# EAGLE board Alpha_Power_Board_v7 (EAGLE 9.6.2), part 1 of 2
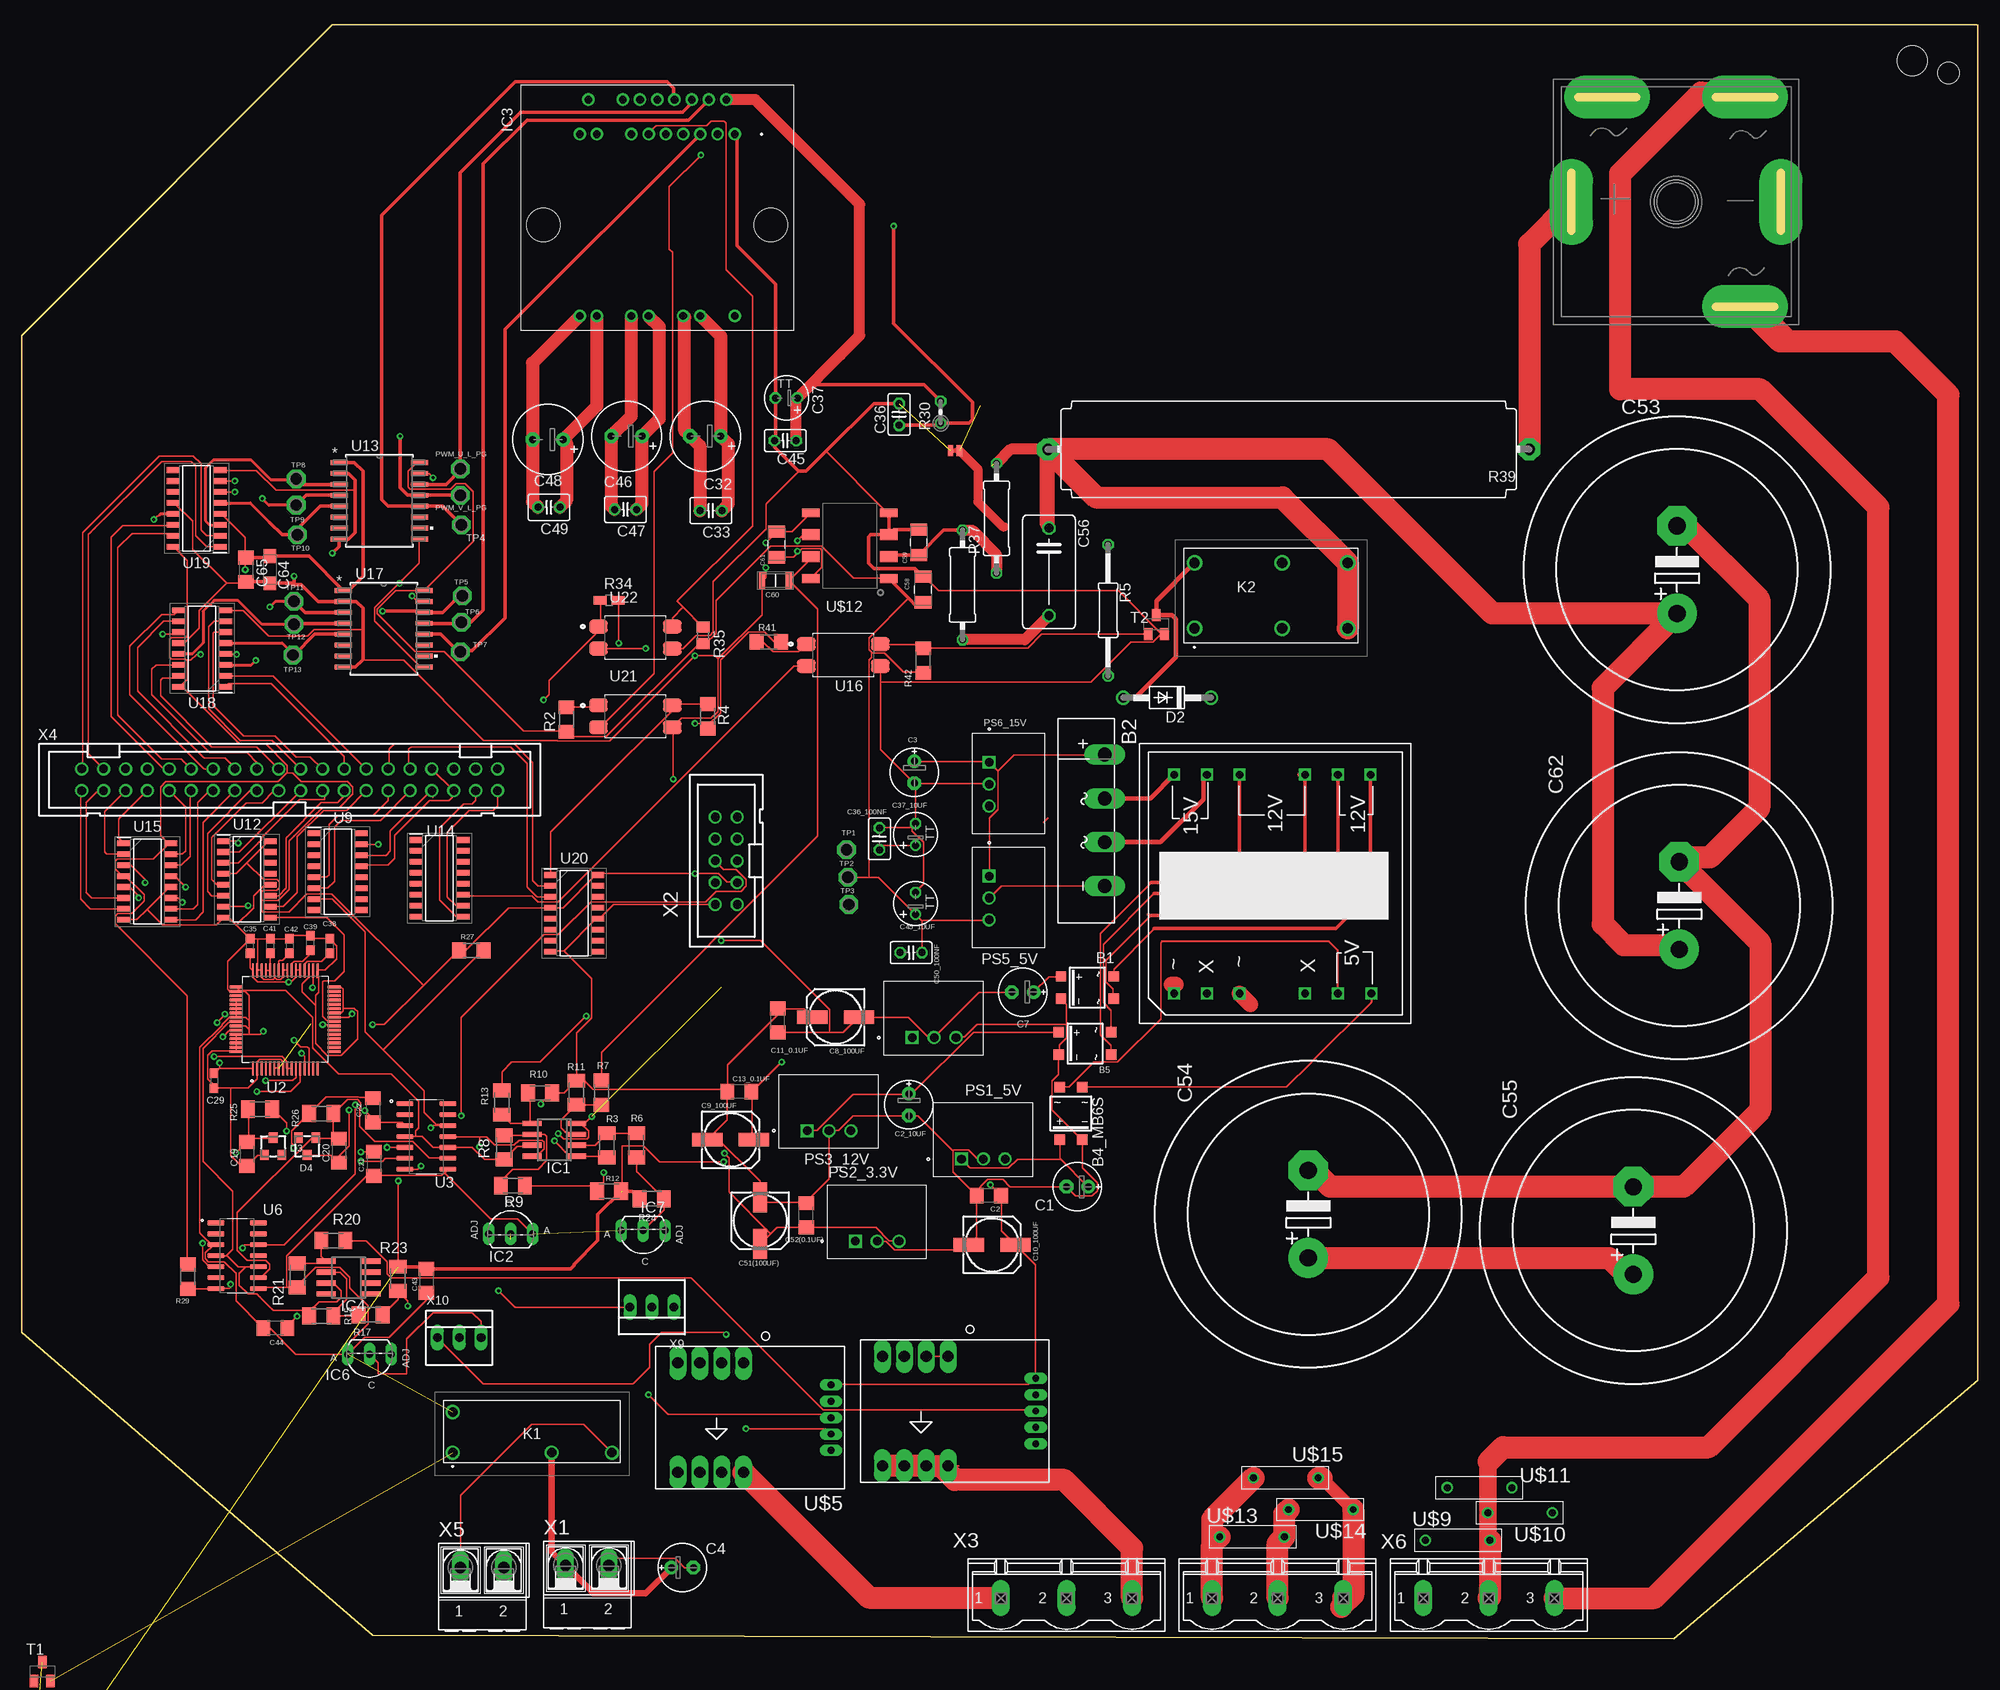
[diagram p7: board, top side]
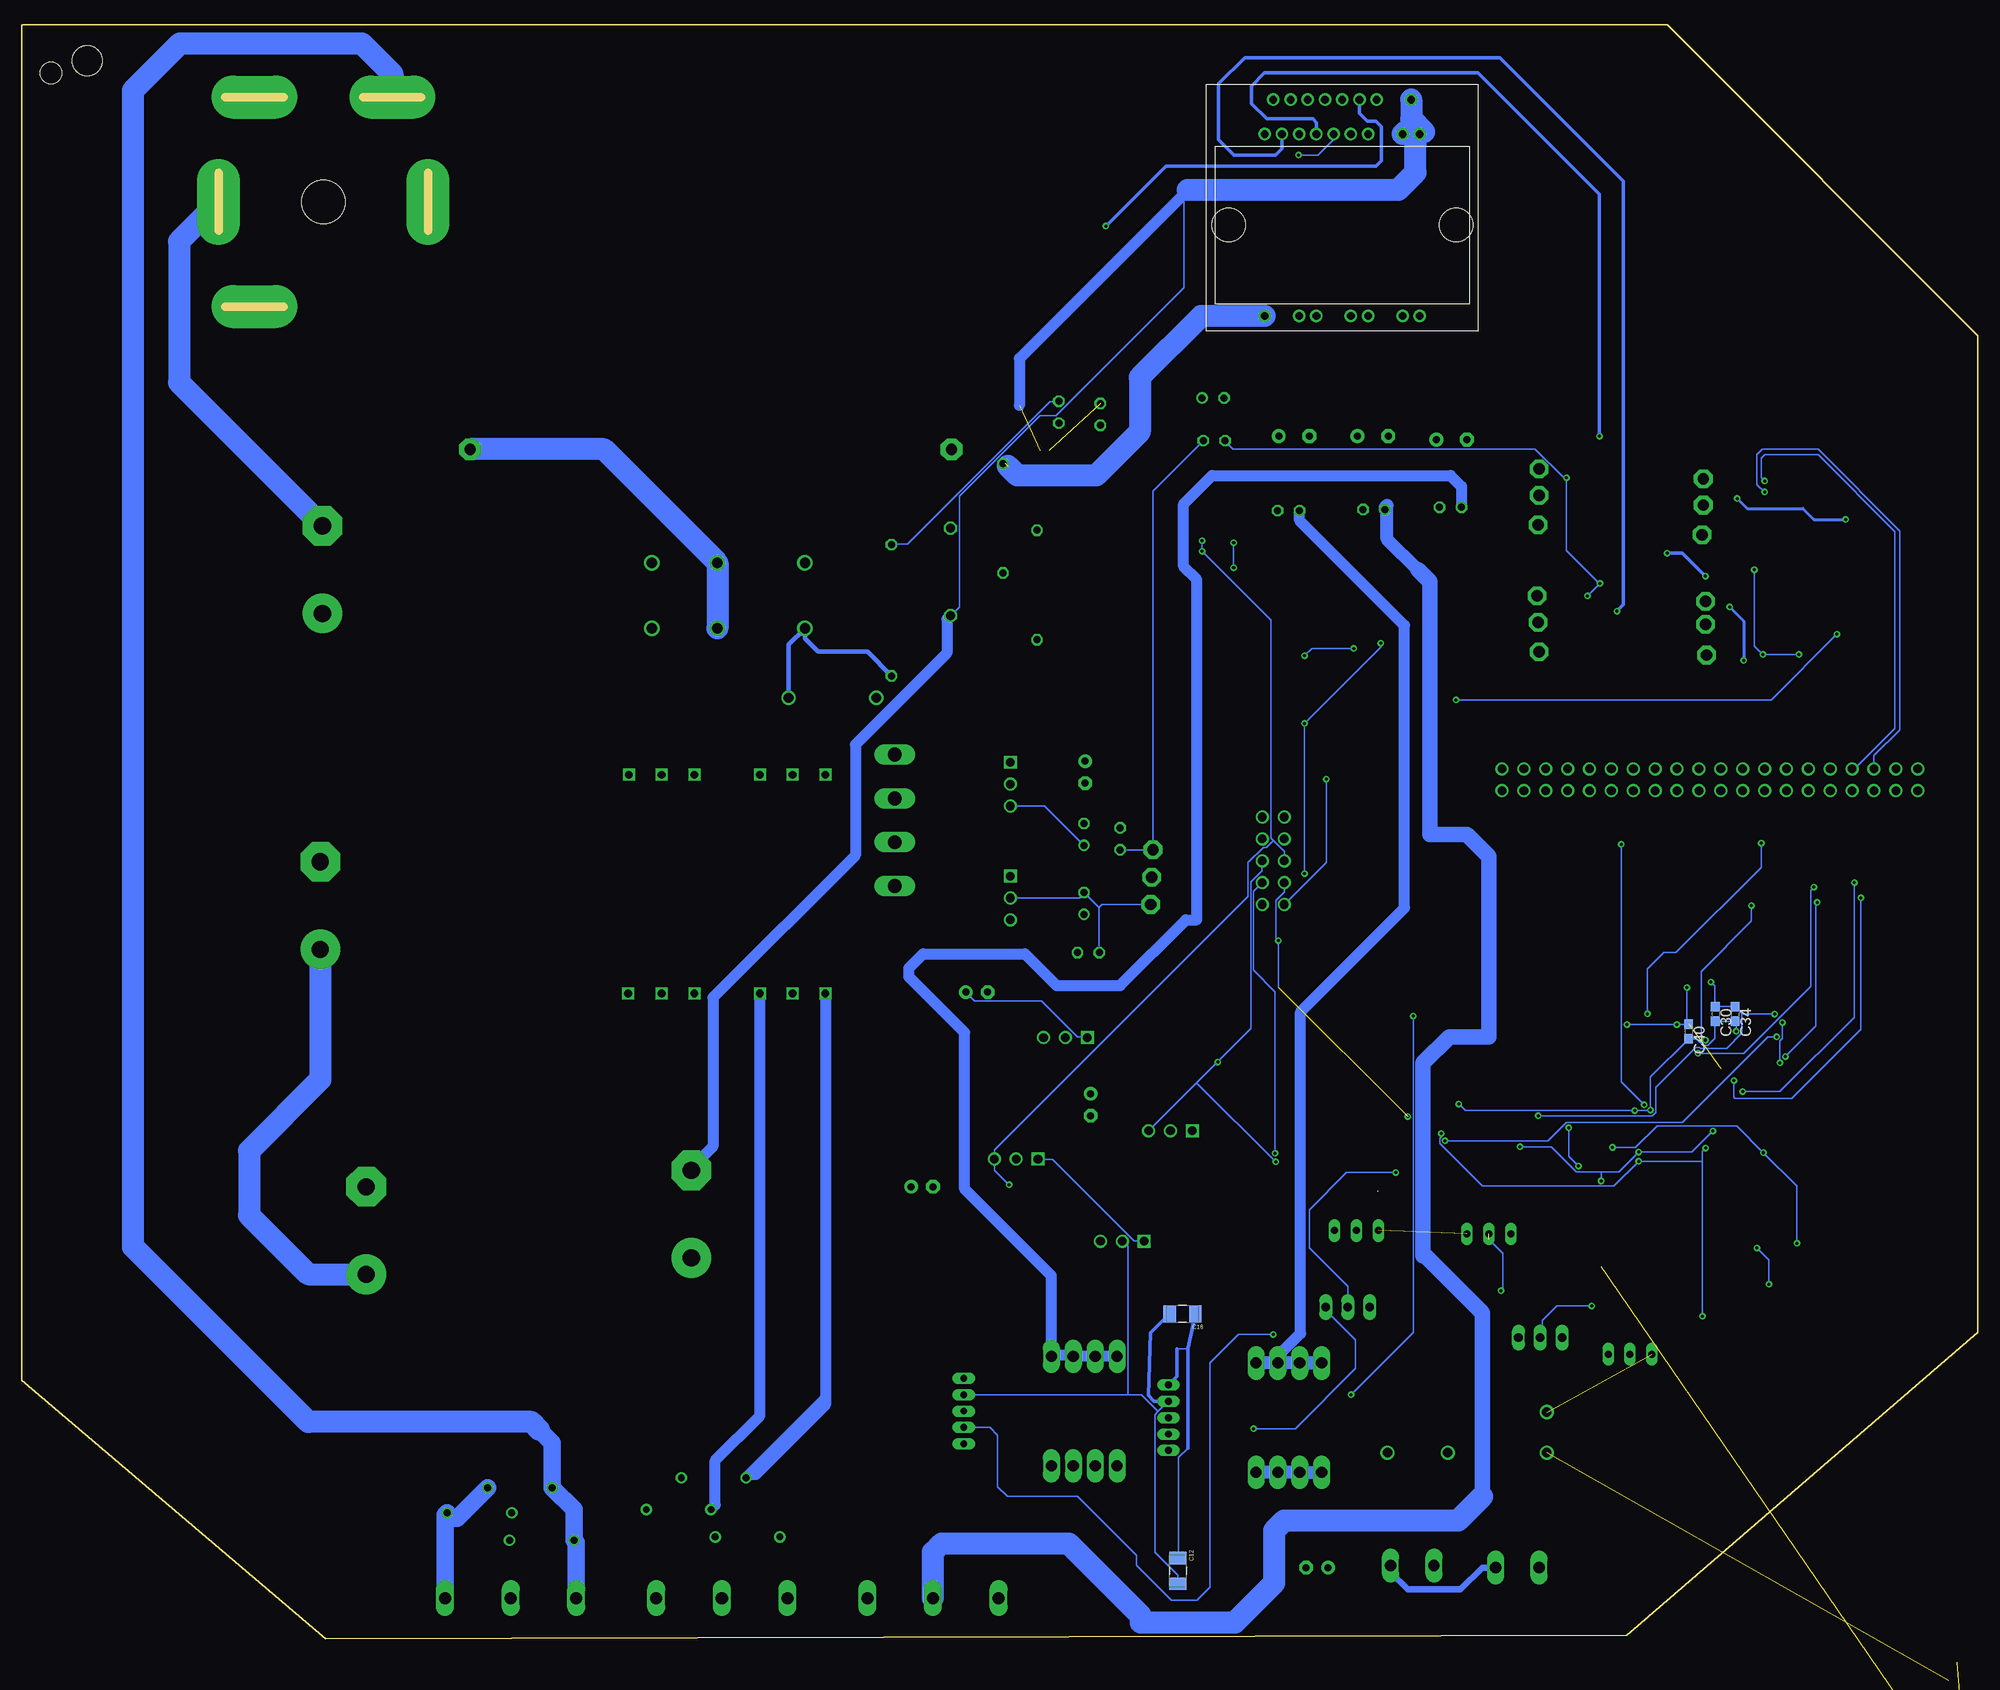
[diagram p8: board, bottom side, seen from below]

Size 227.08 x 187.33 mm. Coordinates in mm from the lower left corner, seen from the top.
Outline: 227.08,187.33 227.08,29.97 191.77,0 40.77,0.38 0,35.56 0,151.26 36.07,187.33 226.95,187.33
Copper layers (1+2*15+16): Top 0.035mm / dielectric 1.5mm / Route2 0.035mm / dielectric 0.15mm / Route15 0.035mm / dielectric 0.2mm / Bottom 0.035mm
Design rules "default *": minimum track width 6mil, minimum drill 0.35mm, track to track 6mil, track to pad 6mil, pad to pad 6mil, via to via 6mil, smd to smd 6mil, copper to edge 6mil, drill to drill 6mil, minimum pad ring 10mil, minimum via ring 8mil, stop-mask expansion 4mil, vias tented up to drill 0mil, thermal gap 10mil
Holes 3.5 mm at 219.46,183.13
Holes 5.08 mm at 192.02,166.75
Holes 2.5 mm at 223.65,181.74

## Footprints (pad centres in the part's own frame; a part is rotated, then mirrored left to right if it is on the bottom)
SOIC-4 = smd 1.2 x 1.2: + 1.3,3.05; - -1.3,3.05; ~1 -1.3,-3.05; ~2 1.3,-3.05
KBU = drill 1.6 long: + -7.62,2.54; - 7.62,2.54; AC1 -2.54,2.54; AC2 2.54,2.54
E2,5-6E = drill 0.813 pad 1.575: + -1.27,0 | drill 0.813 pad 1.575 octagon: - 1.27,0
C1206 = smd 1.6 x 1.8: 1 -1.4,0; 2 1.4,0
153CLV-0605 = smd 3.5 x 1.6: + 2.7,0; - -2.7,0
CAPC3316X140N = smd 1.42 x 1.96: 1 -1.492,0; 2 1.492,0
C0603 = smd 1.1 x 1: 1 -0.85,0; 2 0.85,0
E3,5-8 = drill 0.813 pad 1.6: + -1.778,0 | drill 0.813 pad 1.6 octagon: - 1.778,0
C025-030X050 = drill 0.813 octagon: 1 -1.27,0; 2 1.27,0
C025-025X050 = drill 0.813 octagon: 1 -1.27,0; 2 1.27,0
TT2D5 = drill 0.813: + -1.27,0 | drill 0.813 octagon: - 1.27,0
EB35D = drill 2.007 pad 4.597: + -5.08,0 | drill 2.007 pad 4.597 octagon: - 5.08,0
C102-064X133 = drill 1.016 octagon: 1 -5.08,0; 2 5.08,0
CAP150PF = smd 0.72 x 1.82: 1 -1.55,0; 2 1.55,0
SMC_P = smd 1.6 x 1.4: + -1.575,0; - 1.575,0
DO41-10 = drill 1.118: A 5.08,0; C -5.08,0
TO236 = smd 1 x 1.2: A -1,-1; C 0,1; NC 1,-1
SO08 = smd 0.6 x 2.2: 1 -1.905,-2.6; 2 -0.635,-2.6; 3 0.635,-2.6; 4 1.905,-2.6; 5 1.905,2.6; 6 0.635,2.6; 7 -0.635,2.6; 8 -1.905,2.6
TO92A_VREF = drill 0.813 long: A 2.54,-1.27; C 0,-1.27; R -2.54,-1.27
NFAQ1560R43T = drill 0.89 pad 1.446: 1 -9,-10.55; 2 -8,-14.55; 3 -7,-10.55; 4 -6,-14.55; 5 -5,-10.55; 6 -4,-14.55; 7 -3,-10.55; 8 -2,-14.55; 9 -1,-10.55; 10 0,-14.55; 11 1,-10.55; 12 2,-14.55; 13 3,-10.55; 14 4,-14.55; 17 7,-10.55; 18 8,-14.55; 19 9,-10.55; 20 9,10.55; 22 7,10.55; 26 3,10.55; 28 1,10.55; 32 -3,10.55; 34 -5,10.55; 38 -9,10.55 | hole 3.9: -13.2,0; 13.2,0
ALDP112W = drill 1.1 pad 1.65: 1 0,0; 2 11.5,0; 3 18.5,0; 4 0,4.7
DSP2ADC12V = drill 1.2 pad 1.8: 1 8.89,3.51; 5 -1.27,3.51; 8 -8.89,3.51; 9 -8.89,-4.11; 12 -1.27,-4.11; 16 8.89,-4.11
CONV_R-78E5.0-0.5 = drill 1 square: 1 -2.54,-2.25 | drill 1: 2 0,-2.25; 3 2.54,-2.25
P1-13 = drill 1.321 pad 2.159 octagon: TP 0,0
0204V = drill 0.813 octagon: 1 -1.27,0; 2 1.27,0
R1206 = smd 1.6 x 1.803: 1 -1.422,0; 2 1.422,0
M1206 = smd 1.6 x 2: 1 -1.4,0; 2 1.4,0
0207/15 = drill 0.813 octagon: 1 -7.62,0; 2 7.62,0
R0805W = smd 1.5 x 1: 1 -1.052,0; 2 1.052,0
R0805 = smd 1.3 x 1.5: 1 -0.95,0; 2 0.95,0
0309/12 = drill 0.813 octagon: 1 -6.35,0; 2 6.35,0
B20J50RE = drill 1.3 pad 2.54 octagon: 1 -27.94,0; 2 27.94,0
SOT23-BEC = smd 1 x 1.4: B -0.95,-1.1; C 0,1.1; E 0.95,-1.1
QFP50P1200X1200X160-64N = smd 1.57 x 0.28: 1 -5.67,3.75; 2 -5.67,3.25; 3 -5.67,2.75; 4 -5.67,2.25; 5 -5.67,1.75; 6 -5.67,1.25; 7 -5.67,0.75; 8 -5.67,0.25; 9 -5.67,-0.25; 10 -5.67,-0.75; 11 -5.67,-1.25; 12 -5.67,-1.75; 13 -5.67,-2.25; 14 -5.67,-2.75; 15 -5.67,-3.25; 16 -5.67,-3.75; 33 5.67,-3.75; 34 5.67,-3.25; 35 5.67,-2.75; 36 5.67,-2.25; 37 5.67,-1.75; 38 5.67,-1.25; 39 5.67,-0.75; 40 5.67,-0.25; 41 5.67,0.25; 42 5.67,0.75; 43 5.67,1.25; 44 5.67,1.75; 45 5.67,2.25; 46 5.67,2.75; 47 5.67,3.25; 48 5.67,3.75 | smd 0.28 x 1.57: 17 -3.75,-5.67; 18 -3.25,-5.67; 19 -2.75,-5.67; 20 -2.25,-5.67; 21 -1.75,-5.67; 22 -1.25,-5.67; 23 -0.75,-5.67; 24 -0.25,-5.67; 25 0.25,-5.67; 26 0.75,-5.67; 27 1.25,-5.67; 28 1.75,-5.67; 29 2.25,-5.67; 30 2.75,-5.67; 31 3.25,-5.67; 32 3.75,-5.67; 49 3.75,5.67; 50 3.25,5.67; 51 2.75,5.67; 52 2.25,5.67; 53 1.75,5.67; 54 1.25,5.67; 55 0.75,5.67; 56 0.25,5.67; 57 -0.25,5.67; 58 -0.75,5.67; 59 -1.25,5.67; 60 -1.75,5.67; 61 -2.25,5.67; 62 -2.75,5.67; 63 -3.25,5.67; 64 -3.75,5.67
SOIC127P600X175-14N = smd 1.97 x 0.6: 1 -2.475,3.81; 2 -2.475,2.54; 3 -2.475,1.27; 4 -2.475,0; 5 -2.475,-1.27; 6 -2.475,-2.54; 7 -2.475,-3.81; 8 2.475,-3.81; 9 2.475,-2.54; 10 2.475,-1.27; 11 2.475,0; 12 2.475,1.27; 13 2.475,2.54; 14 2.475,3.81
SOIC_16 = smd 1.525 x 0.65: 1 -2.712,4.445; 2 -2.712,3.175; 3 -2.712,1.905; 4 -2.712,0.635; 5 -2.712,-0.635; 6 -2.712,-1.905; 7 -2.712,-3.175; 8 -2.712,-4.445; 9 2.712,-4.445; 10 2.712,-3.175; 11 2.712,-1.905; 12 2.712,-0.635; 13 2.712,0.635; 14 2.712,1.905; 15 2.712,3.175; 16 2.712,4.445
RW_16_ADI = smd 1.981 x 0.559: 1 -4.686,4.445; 2 -4.686,3.175; 3 -4.686,1.905; 4 -4.686,0.635; 5 -4.686,-0.635; 6 -4.686,-1.905; 7 -4.686,-3.175; 8 -4.686,-4.445; 9 4.686,-4.445; 10 4.686,-3.175; 11 4.686,-1.905; 12 4.686,-0.635; 13 4.686,0.635; 14 4.686,1.905; 15 4.686,3.175; 16 4.686,4.445
SOIC254P975X460-4N = smd 2.13 x 1.57: 1 -4.29,1.27; 2 -4.29,-1.27; 3 4.29,-1.27; 4 4.29,1.27
T1P2S = drill 0.9 square: P$1 2.5,26.5; P$2 2.5,22.7; P$3 2.5,18.9; P$4 2.5,11.3; P$5 2.5,7.5; P$6 2.5,3.6; P$7 27.9,3.7; P$8 27.9,7.5; P$9 27.9,11.3; P$10 27.9,18.9; P$11 27.9,22.7; P$12 27.9,26.5
GND_CONNECT = smd 0.635 x 1.27: 1 -0.508,0; 2 0.508,0
LPSR-15-NP = drill 1.3 pad 1.9 long: 2 -4.42,-6.35; 3 -1.88,-6.35; 4 0.66,-6.35; 5 3.2,-6.35; 6 3.2,6.35; 7 0.66,6.35; 8 -1.88,6.35; 9 -4.42,6.35 | drill 0.8 pad 1.3 long: 11 -14.59,3.81; 12 -14.59,1.905; 13 -14.59,0; 14 -14.59,-1.905; 15 -14.59,-3.81
V250LT20AP = drill 0.8: 1 0,0; 2 7.5,0
HCPL-7510 = smd 1.016 x 2: 1 -3.82,-4.52; 4 3.8,-4.52; 5 3.8,4.52; 8 -3.82,4.52 | smd 1.27 x 2: 2 -1.28,-4.52; 3 1.26,-4.52; 6 1.26,4.52; 7 -1.28,4.52
3-PHASE-BRIDGE = drill 0.6 pad 5 long: P$1 2.1,14.25; P$2 26.4,14.25; P$3 6.25,26.4; P$4 22.25,26.4; P$5 22.25,2.1
AK500/2-H = drill 1.321 long: 1 -2.515,0; 2 2.515,0
PAK100/2500-10 = drill 1 pad 1.422: 1 -5.08,-1.27; 2 -5.08,1.27; 3 -2.54,-1.27; 4 -2.54,1.27; 5 0,-1.27; 6 0,1.27; 7 2.54,-1.27; 8 2.54,1.27; 9 5.08,-1.27; 10 5.08,1.27
GMSTBV3 = drill 1.397 long: 1 -7.62,0; 2 0,0; 3 7.62,0
PAK100/2500-40 = drill 1 pad 1.422: 1 -24.13,-1.27; 2 -24.13,1.27; 3 -21.59,-1.27; 4 -21.59,1.27; 5 -19.05,-1.27; 6 -19.05,1.27; 7 -16.51,-1.27; 8 -16.51,1.27; 9 -13.97,-1.27; 10 -13.97,1.27; 11 -11.43,-1.27; 12 -11.43,1.27; 13 -8.89,-1.27; 14 -8.89,1.27; 15 -6.35,-1.27; 16 -6.35,1.27; 17 -3.81,-1.27; 18 -3.81,1.27; 19 -1.27,-1.27; 20 -1.27,1.27; 21 1.27,-1.27; 22 1.27,1.27; 23 3.81,-1.27; 24 3.81,1.27; 25 6.35,-1.27; 26 6.35,1.27; 27 8.89,-1.27; 28 8.89,1.27; 29 11.43,-1.27; 30 11.43,1.27; 31 13.97,-1.27; 32 13.97,1.27; 33 16.51,-1.27; 34 16.51,1.27; 35 19.05,-1.27; 36 19.05,1.27; 37 21.59,-1.27; 38 21.59,1.27; 39 24.13,-1.27; 40 24.13,1.27
22-23-2031 = drill 1 long: 1 -2.54,0; 2 0,0; 3 2.54,0

## Placement (x,y rotation side)
B1  MB6S  [SOIC-4]  123.7,75.56 90 top
B2  KBU0101  [KBU]  123.19,95 270 top
B4_MB6S  MB6S  [SOIC-4]  121.79,60.96 180 top
B5  MB6S  [SOIC-4]  123.44,69.09 90 top
C1  10uF  [E2,5-6E]  122.55,52.45 180 top
C2  0.1 uF  [C1206]  112.27,51.44 180 top
C2_10UF  10uF  [E2,5-6E]  103,61.98 270 top
C3  22uF  [E2,5-6E]  103.63,100.58 270 top
C4  10uF  [E2,5-6E]  76.71,8.26 0 top
C7  10uF  [E2,5-6E]  116.2,75.06 180 top
C8_100UF  100 uF  [153CLV-0605]  94.49,72.14 180 top
C9_100UF  100 uF  [153CLV-0605]  82.3,57.91 0 top
C10_100UF  100 uF  [153CLV-0605]  112.65,45.72 0 top
C11_0.1UF  0.1 uF  [C1206]  87.76,71.75 90 top
C12  0.1uF  [CAPC3316X140N]  92.84,7.87 270 bottom
C13_0.1UF  0.1 uF  [C1206]  83.31,63.5 180 top
C16  0.1uF  [CAPC3316X140N]  92.33,37.72 180 bottom
C19  0.1 uF  [C1206]  26.16,56.26 270 top
C20  0.1 uF  [C1206]  36.83,56.64 270 top
C21  0.1 uF  [C1206]  40.92,55.12 270 top
C22  0.1 uF  [C1206]  40.77,61.34 270 top
C29  1uF  [C0603]  22.35,64.77 270 top
C30  1uF  [C0603]  30.48,72.52 270 bottom
C32  1 - 47uF  [E3,5-8]  79.37,139.57 180 top
C33  100 nF  [C025-030X050]  80.01,130.94 180 top
C34  1uF  [C0603]  28.19,72.52 270 bottom
C35  1uF  [C0603]  26.54,80.39 90 top
C36  1 nF  [C025-025X050]  101.85,142.11 90 top
C36_100NF  100 nF  [C025-025X050]  99.57,92.84 90 top
C37  10 uF  [TT2D5]  88.77,144.02 180 top
C37_10UF  10 uF  [TT2D5]  103.76,93.34 90 top
C38  1uF  [C0603]  35.81,80.42 90 top
C39  1uF  [C0603]  33.53,80.77 90 top
C40  1uF  [C0603]  33.58,70.48 270 bottom
C41  10uF  [C0603]  28.88,80.39 90 top
C42  10uF  [C0603]  31.11,80.39 270 top
C43  0.1 uF  [C1206]  46.99,41.53 270 top
C44  0.1 uF  [C1206]  29.46,36.07 180 top
C45  100 nF  [C025-025X050]  88.65,139.06 180 top
C45_10UF  10 uF  [TT2D5]  103.76,85.34 90 top
C46  1 - 47uF  [E3,5-8]  70.23,139.57 180 top
C47  100 nF  [C025-030X050]  70.1,131.06 180 top
C48  1 - 47uF  [E3,5-8]  61.09,139.19 180 top
C49  100 nF  [C025-030X050]  61.21,131.32 180 top
C50_100NF  100 nF  [C025-025X050]  103.25,79.63 180 top
C51(100UF)  100 uF  [153CLV-0605]  85.73,48.51 270 top
C52(0.1UF)  0.1 uF  [C1206]  91.06,49.15 90 top
C53  4700uF  [EB35D]  192.15,124.08 90 top
C54  4700uF  [EB35D]  149.35,49.28 90 top
C55  4700uF  [EB35D]  187.07,47.37 90 top
C56  100 nF 450V  [C102-064X133]  119.25,123.83 270 top
C58  0.1uF  [CAPC3316X140N]  104.65,121.79 90 top
C59  0.01uF  [CAPC3316X140N]  104.14,127.25 90 top
C60  150pF  [CAP150PF]  87.5,122.81 180 top
C61  0.1uF  [CAPC3316X140N]  87.63,127 90 top
C62  4700uF  [EB35D]  192.4,85.09 90 top
C64  10 uF  [SMC_P]  28.83,124.08 270 top
C65  100 nF  [C1206]  26.03,124.08 270 top
D2  1N4004  [DO41-10]  132.97,109.22 180 top
D3  [TO236]  29.21,57.15 0 top
D4  [TO236]  33.15,57.15 180 top
IC1  LF353D  [SO08]  61.85,57.91 90 top
IC2  LM336-  [TO92A_VREF]  56.77,48.26 0 top
IC3  NFAQ1560R43T  [NFAQ1560R43T]  73.79,164.08 180 top
IC4  LF353D  [SO08]  37.97,41.91 90 top
IC6  LM336-  [TO92A_VREF]  40.39,31.75 180 top
IC7  LM336-  [TO92A_VREF]  72.14,46.1 180 top
K1  ALDP112W  [ALDP112W]  50.04,21.59 0 top
K2  DSP2A-DC12V  [DSP2ADC12V]  145.03,120.78 180 top
PS1_5V  R-785.0-0.5  [CONV_R-78E5.0-0.5]  111.63,57.91 0 top
PS2_3.3V  R-783.3-0.5  [CONV_R-78E5.0-0.5]  99.31,48.39 0 top
PS3_12V  R-7812.0-0.5  [CONV_R-78E5.0-0.5]  93.73,61.21 0 top
PS4_12V  R-78B12.0-0.5  [CONV_R-78E5.0-0.5]  105.92,72.01 0 top
PS5_5V  R-785.0-0.5  [CONV_R-78E5.0-0.5]  114.55,85.98 270 top
PS6_15V  R-7815.0-0.5  [CONV_R-78E5.0-0.5]  114.55,99.19 270 top
PWM_U_L_PG  PTR1PAD1-13  [P1-13]  50.93,135.76 0 top
PWM_V_L_PG  PTR1PAD1-13  [P1-13]  50.93,132.72 0 top
R1  1k  [0204V]  2.67,-8.76 0 top  (outside the outline)
R2  [R1206]  63.25,106.68 270 top
R3  4.7k  [M1206]  67.95,57.28 270 top
R4  [R1206]  79.63,107.06 270 top
R5  120 ohm  [0207/15]  126.11,119.38 270 top
R6  1.5k  [M1206]  71.37,57.28 90 top
R7  1.5k  [R1206]  67.31,63.37 270 top
R8  8k  [M1206]  56.01,57.02 270 top
R9  1k  [M1206]  57.02,52.58 180 top
R10  8k  [M1206]  60.2,63.35 0 top
R11  4.7k  [M1206]  64.39,63.37 90 top
R12  2.2K  [M1206]  68.2,51.94 0 top
R13  1k  [M1206]  55.75,62.23 270 top
R14  1k  [0204V]  2.67,-14.61 0 top  (outside the outline)
R15  8k  [M1206]  34.8,37.47 180 top
R17  1k  [M1206]  40.51,37.59 180 top
R20  1k  [M1206]  36.19,46.23 180 top
R21  8k  [M1206]  32,42.16 270 top
R23  2.2k  [M1206]  43.69,41.78 90 top
R24  2.2k  [M1206]  73.15,51.05 180 top
R25  [M1206]  27.69,61.47 0 top
R26  [M1206]  34.8,60.96 180 top
R27  1K  [R1206]  52.2,79.88 180 top
R29  1K  [R1206]  19.3,42.04 90 top
R30  1k  [0204V]  106.68,142.37 90 top
R34  [R0805W]  68.2,120.52 0 top
R35  [R0805]  79.12,116.46 270 top
R37  [0309/12]  113.16,130.05 90 top
R38  [0309/12]  109.22,122.3 90 top
R39  50 ohm 20W  [B20J50RE]  147.07,138.05 180 top
R41  [R1206]  86.74,115.7 0 top
R42  1K  [R1206]  104.65,113.54 270 top
T1  [SOT23-BEC]  2.41,-3.81 0 top
T2  [SOT23-BEC]  131.7,117.73 0 top
TP1  PTR1PAD1-13  [P1-13]  95.76,91.57 0 top
TP2  PTR1PAD1-13  [P1-13]  95.89,88.39 0 top
TP3  PTR1PAD1-13  [P1-13]  96.01,85.22 0 top
TP4  PTR1PAD1-13  [P1-13]  51.05,129.29 0 top
TP5  PTR1PAD1-13  [P1-13]  51.18,121.03 0 top
TP6  PTR1PAD1-13  [P1-13]  51.05,117.98 0 top
TP7  PTR1PAD1-13  [P1-13]  50.93,114.55 0 top
TP8  PTR1PAD1-13  [P1-13]  31.88,134.62 0 top
TP9  PTR1PAD1-13  [P1-13]  31.88,131.57 0 top
TP10  PTR1PAD1-13  [P1-13]  32,128.14 0 top
TP11  PTR1PAD1-13  [P1-13]  31.62,120.4 0 top
TP12  PTR1PAD1-13  [P1-13]  31.62,117.73 0 top
TP13  PTR1PAD1-13  [P1-13]  31.5,114.17 0 top
U2  ADS8584SIPM  [QFP50P1200X1200X160-64N]  30.61,71.88 90 top
U3  LM319M  [SOIC127P600X175-14N]  46.99,58.29 0 top
U6  LM319M  [SOIC127P600X175-14N]  25.02,44.45 0 top
U9  DS26LS31  [SOIC_16]  36.7,89.03 0 top
U12  DS26LS31  [SOIC_16]  26.16,88.14 0 top
U13  ADUM1310BRWZ-RL  [RW_16_ADI]  41.53,132.08 0 top
U14  DS26LS32  [SOIC_16]  48.51,88.27 0 top
U15  DS26LS32  [SOIC_16]  14.61,87.88 0 top
U16  PC817XI  [SOIC254P975X460-4N]  95.38,114.17 0 top
U17  ADUM1310BRWZ-RL  [RW_16_ADI]  42.04,117.22 0 top
U18  DS26LS32  [SOIC_16]  20.95,114.94 180 top
U19  DS26LS32  [SOIC_16]  20.32,131.19 180 top
U20  DS26LS31  [SOIC_16]  64.14,84.2 0 top
U21  PC817XI  [SOIC254P975X460-4N]  71.25,107.06 0 top
U22  PC817XI  [SOIC254P975X460-4N]  71.25,116.2 0 top
U$1  TRANSFORMERTHROUGH-HOLE  [T1P2S]  160.27,72.39 90 top
U$2  GND_CONNECT  [GND_CONNECT]  108.33,137.92 180 top
U$5  LSPR-6-NP  [LPSR-15-NP]  79.37,25.65 180 top
U$7  LSPR-6-NP  [LPSR-15-NP]  103.12,26.42 180 top
U$9  V250LT20AP  [V250LT20AP]  162.94,11.43 0 top
U$10  V250LT20AP  [V250LT20AP]  177.67,14.61 180 top
U$11  V250LT20AP  [V250LT20AP]  172.97,17.53 180 top
U$12  HCPL-7510  [HCPL-7510]  96.14,126.87 90 top
U$13  V250LT20AP  [V250LT20AP]  139.06,11.81 0 top
U$14  V250LT20AP  [V250LT20AP]  154.56,14.99 180 top
U$15  V250LT20AP  [V250LT20AP]  150.5,18.67 180 top
U$16  3-PHASE-BRIDGE  [3-PHASE-BRIDGE]  177.8,152.53 0 top
X1  [AK500/2-H]  65.66,8.51 0 top
X2  2510-  [PAK100/2500-10]  81.79,90.3 90 top
X3  GMSTBV3  [GMSTBV3]  121.29,4.7 0 top
X4  2540-  [PAK100/2500-40]  31.11,99.7 0 top
X5  [AK500/2-H]  53.47,8.26 0 top
X6  GMSTBV3  [GMSTBV3]  170.31,4.7 0 top
X7  GMSTBV3  [GMSTBV3]  145.8,4.7 0 top
X9  22-23-2031  [22-23-2031]  73.15,38.48 180 top
X10  22-23-2031  [22-23-2031]  50.8,34.92 0 top